# Altium schematic sheet Connector-side-1.SchDoc: =ProjectTitle
size 297 x 209 mm; Address1: Address1; Address2: Address2; Address3: Address3; Address4: Address4; SheetNumber: 2; SheetTotal: 6; Scale: 1:1; DocumentType: Схема электрическая принципиальная
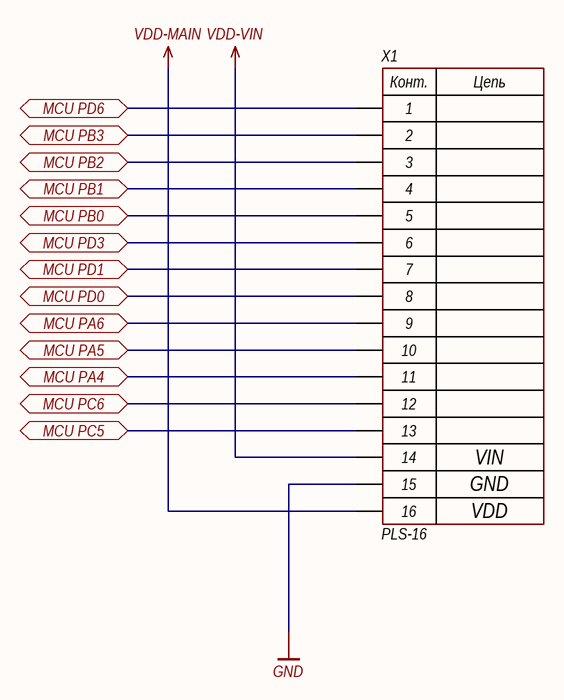
[diagram p0: Connector-side-1.SchDoc]

## Parts
X1  PLS-16  [CON: PLS-16]

## Ports
MCU PA4 (bidir), MCU PA5 (bidir), MCU PA6 (bidir), MCU PB0 (bidir), MCU PB1 (bidir), MCU PB2 (bidir), MCU PB3 (bidir), MCU PC5 (bidir), MCU PC6 (bidir), MCU PD0 (bidir), MCU PD1 (bidir), MCU PD3 (bidir), MCU PD6 (bidir)

## Nets
GND: X1.15
VDD-MAIN: X1.16
VDD-VIN: X1.14
MCU PA4: X1.11 ; port MCU PA4
MCU PA5: X1.10 ; port MCU PA5
MCU PA6: X1.9 ; port MCU PA6
MCU PB0: X1.5 ; port MCU PB0
MCU PB1: X1.4 ; port MCU PB1
MCU PB2: X1.3 ; port MCU PB2
MCU PB3: X1.2 ; port MCU PB3
MCU PC5: X1.13 ; port MCU PC5
MCU PC6: X1.12 ; port MCU PC6
MCU PD0: X1.8 ; port MCU PD0
MCU PD1: X1.7 ; port MCU PD1
MCU PD3: X1.6 ; port MCU PD3
MCU PD6: X1.1 ; port MCU PD6

## Notes on the sheet
- VIN
- GND
- VDD
- Изм.
- Лист
- № докум.
- Подп.
- Дата
- Копировал
- Формат А4
- (in symbol 16-Connector) Конт.; Цепь

## Library data of the parts
X1 = 16-Connector: Model: PLS-16; Manufacturer: *; HelpURL: *; ComponentKind: *